# EAGLE schematic scheme (EAGLE 8.4.1)
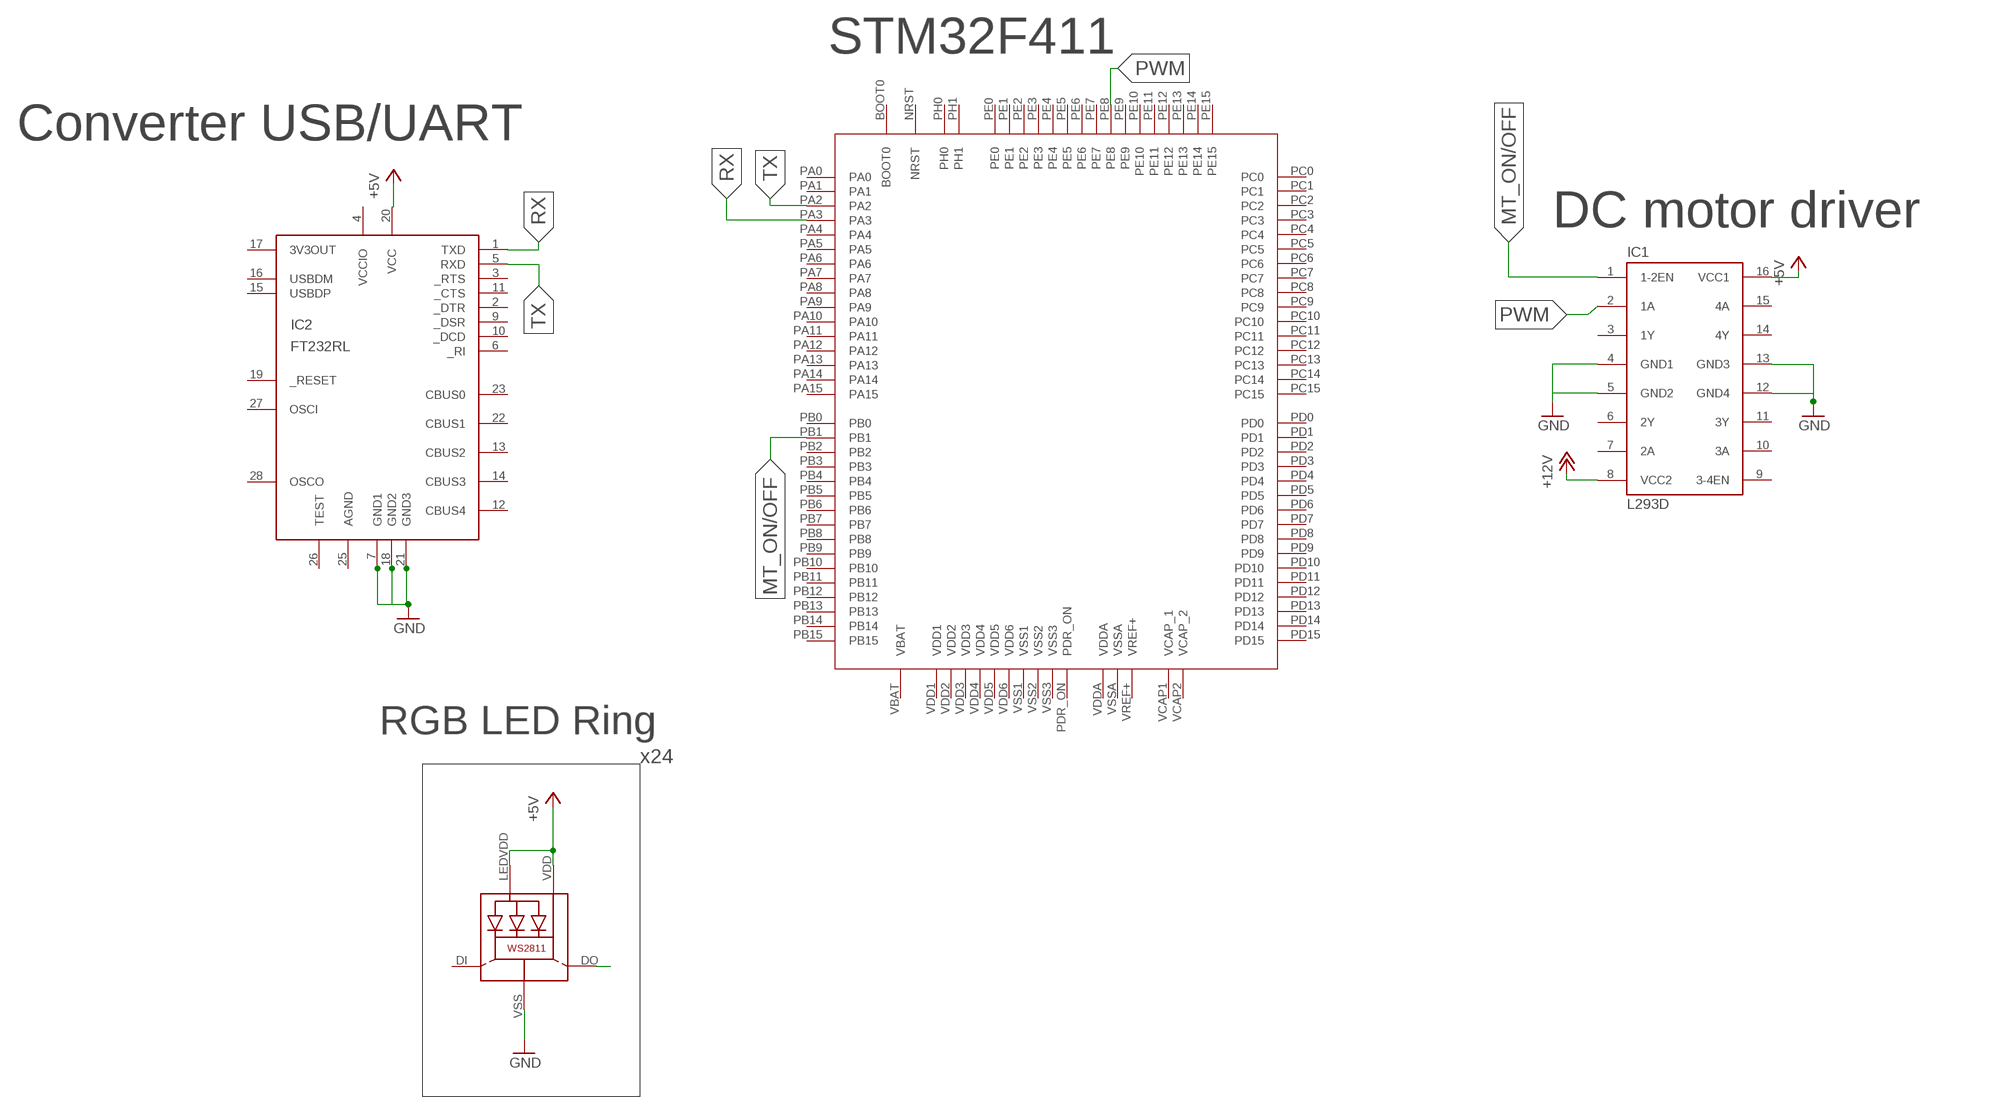
[diagram p0: schematic, sheet 1]

## Parts
IC1  L293D  [DIL16]
IC2  FT232RL  [SSOP28DB]
LED12  WS28115050  [WS28115050]
U$2  STM32F4V_100PIN_GENERIC  [LQFP100]

## Nets
+5V: IC1.16(VCC1) IC2.20(VCC) LED12.LEDVDD LED12.VDD
+12V: IC1.8(VCC2)
GND: IC1.4(GND1) IC1.5(GND2) IC1.12(GND4) IC1.13(GND3) IC2.7(GND1) IC2.18(GND2) IC2.21(GND3) LED12.VSS(GND)
MT_ON/OFF: IC1.1(1-2EN) U$2.PB1
N$12: LED12.DO
PWM: IC1.2(1A) U$2.PE8
RX: IC2.1(TXD) U$2.PA3
TX: IC2.5(RXD) U$2.PA2
Unconnected: IC1.3(1Y) IC1.6(2Y) IC1.7(2A) IC1.9(3-4EN) IC1.10(3A) IC1.11(3Y) IC1.14(4Y) IC1.15(4A) IC2.2(_DTR) IC2.3(_RTS) IC2.6(_RI) IC2.9(_DSR) IC2.10(_DCD) IC2.11(_CTS) IC2.12(CBUS4) IC2.13(CBUS2) IC2.14(CBUS3) IC2.15(USBDP) IC2.16(USBDM) IC2.17(3V3OUT) IC2.19(_RESET) IC2.22(CBUS1) IC2.23(CBUS0) IC2.26(TEST) IC2.27(OSCI) IC2.28(OSCO) LED12.DI U$2.BOOT0 U$2.NRST U$2.PA0 U$2.PA1 U$2.PA4 U$2.PA5 U$2.PA6 U$2.PA7 U$2.PA8 U$2.PA9 U$2.PA10 U$2.PA11 U$2.PA12 U$2.PA13 U$2.PA14 U$2.PA15 U$2.PB0 U$2.PB2 U$2.PB3 U$2.PB4 U$2.PB5 U$2.PB6 U$2.PB7 U$2.PB8 U$2.PB9 U$2.PB10 U$2.PB11 U$2.PB12 U$2.PB13 U$2.PB14 U$2.PB15 U$2.PC0 U$2.PC1 U$2.PC2 U$2.PC3 U$2.PC4 U$2.PC5 U$2.PC6 U$2.PC7 U$2.PC8 U$2.PC9 U$2.PC10 U$2.PC11 U$2.PC12 U$2.PC13 U$2.PC14 U$2.PC15 U$2.PD0 U$2.PD1 U$2.PD2 U$2.PD3 U$2.PD4 U$2.PD5 U$2.PD6 U$2.PD7 U$2.PD8 U$2.PD9 U$2.PD10 U$2.PD11 U$2.PD12 U$2.PD13 U$2.PD14 U$2.PD15 U$2.PDR_ON U$2.PE0 U$2.PE1 U$2.PE2 U$2.PE3 U$2.PE4 U$2.PE5 U$2.PE6 U$2.PE7 U$2.PE9 U$2.PE10 U$2.PE11 U$2.PE12 U$2.PE13 U$2.PE14 U$2.PE15 U$2.PH0 U$2.PH1 U$2.VBAT U$2.VCAP1(VCAP_1) U$2.VCAP2(VCAP_2) U$2.VDD1 U$2.VDD2 U$2.VDD3 U$2.VDD4 U$2.VDD5 U$2.VDD6 U$2.VDDA U$2.VREF+ U$2.VSS1 U$2.VSS2 U$2.VSS3 U$2.VSSA

## Notes on the sheet
- STM32F411
- Converter USB/UART
- DC motor driver
- RGB LED Ring
- x24

## Power pins joined to a net without a drawn wire
AGND: IC2.25(AGND)
VCCIO: IC2.4(VCCIO)

## Library data of the parts
IC1 = st-microelectronics:L293D: PUSH-PULL 4 CHANNEL DRIVER; MPN: L293D; OC_FARNELL: 9589619; OC_NEWARK: 56P8249
IC2 = ftdichip-3:FT232RL: USB UART 4th Generation USB UART (USB <-> Serial) Controller
LED12 = microbuilder:WS28115050
U$2 = stm32f4:STM32F4V_100PIN_GENERIC